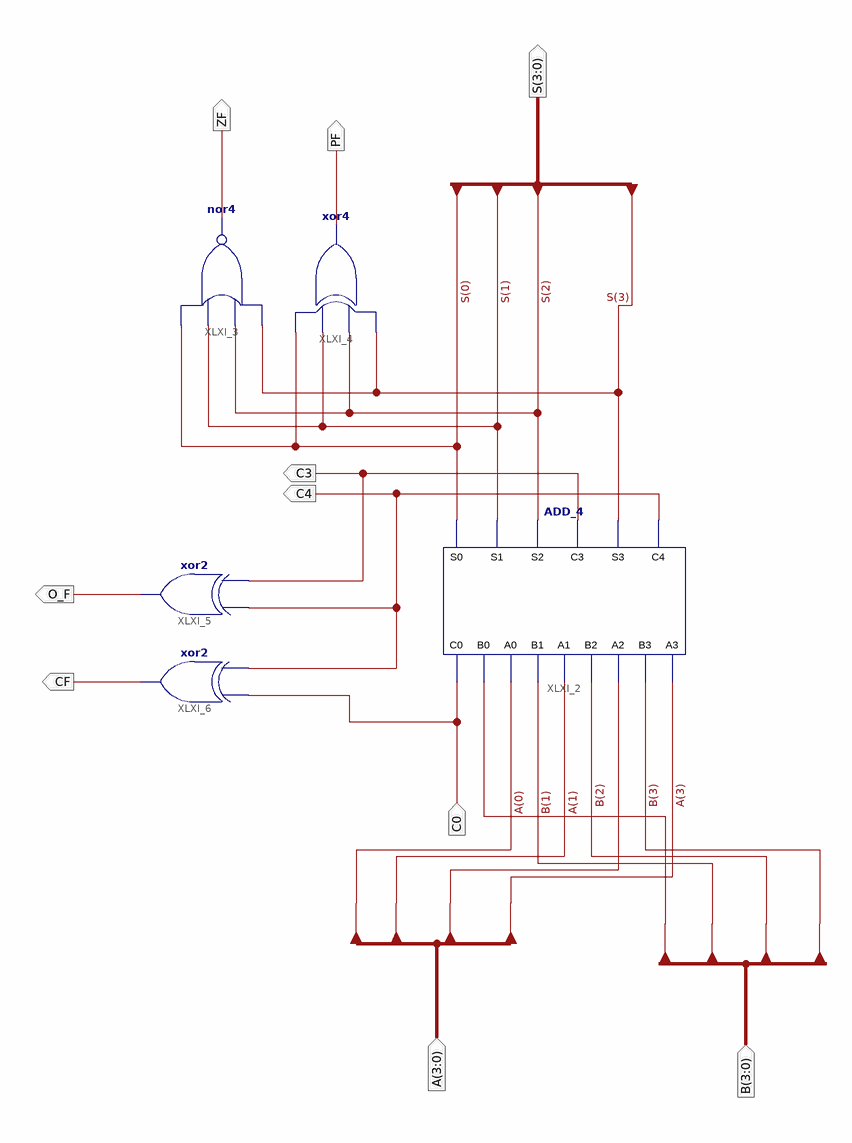
[diagram p0: schematic sheet 1]
// Xilinx ISE schematic ADD_4_plus.sch (spartan3) as structural Verilog: 5 symbols, 10 ports
module ADD_4_plus (
  input  C0,
  input  [3:0] A,
  input  [3:0] B,
  output C4,
  output C3,
  output O_F,
  output CF,
  output ZF,
  output PF,
  output [3:0] S
);

  ADD_4 XLXI_2 (
    .C0(C0), .B0(B[0]), .A0(A[0]), .B1(B[1]), .A1(A[1]), .B2(B[2]), .A2(A[2]), .B3(B[3]), .A3(A[3]),
    .S0(S[0]), .S1(S[1]), .S2(S[2]), .C3(C3), .S3(S[3]), .C4(C4));
  nor XLXI_3 (ZF, S[3], S[2], S[1], S[0]);
  xor XLXI_4 (PF, S[3], S[2], S[1], S[0]);
  xor XLXI_5 (O_F, C3, C4);
  xor XLXI_6 (CF, C4, C0);
endmodule
